# EAGLE schematic USB IMU Board (EAGLE 7.3.0)

## Sheet 1 of 2: USB Hub
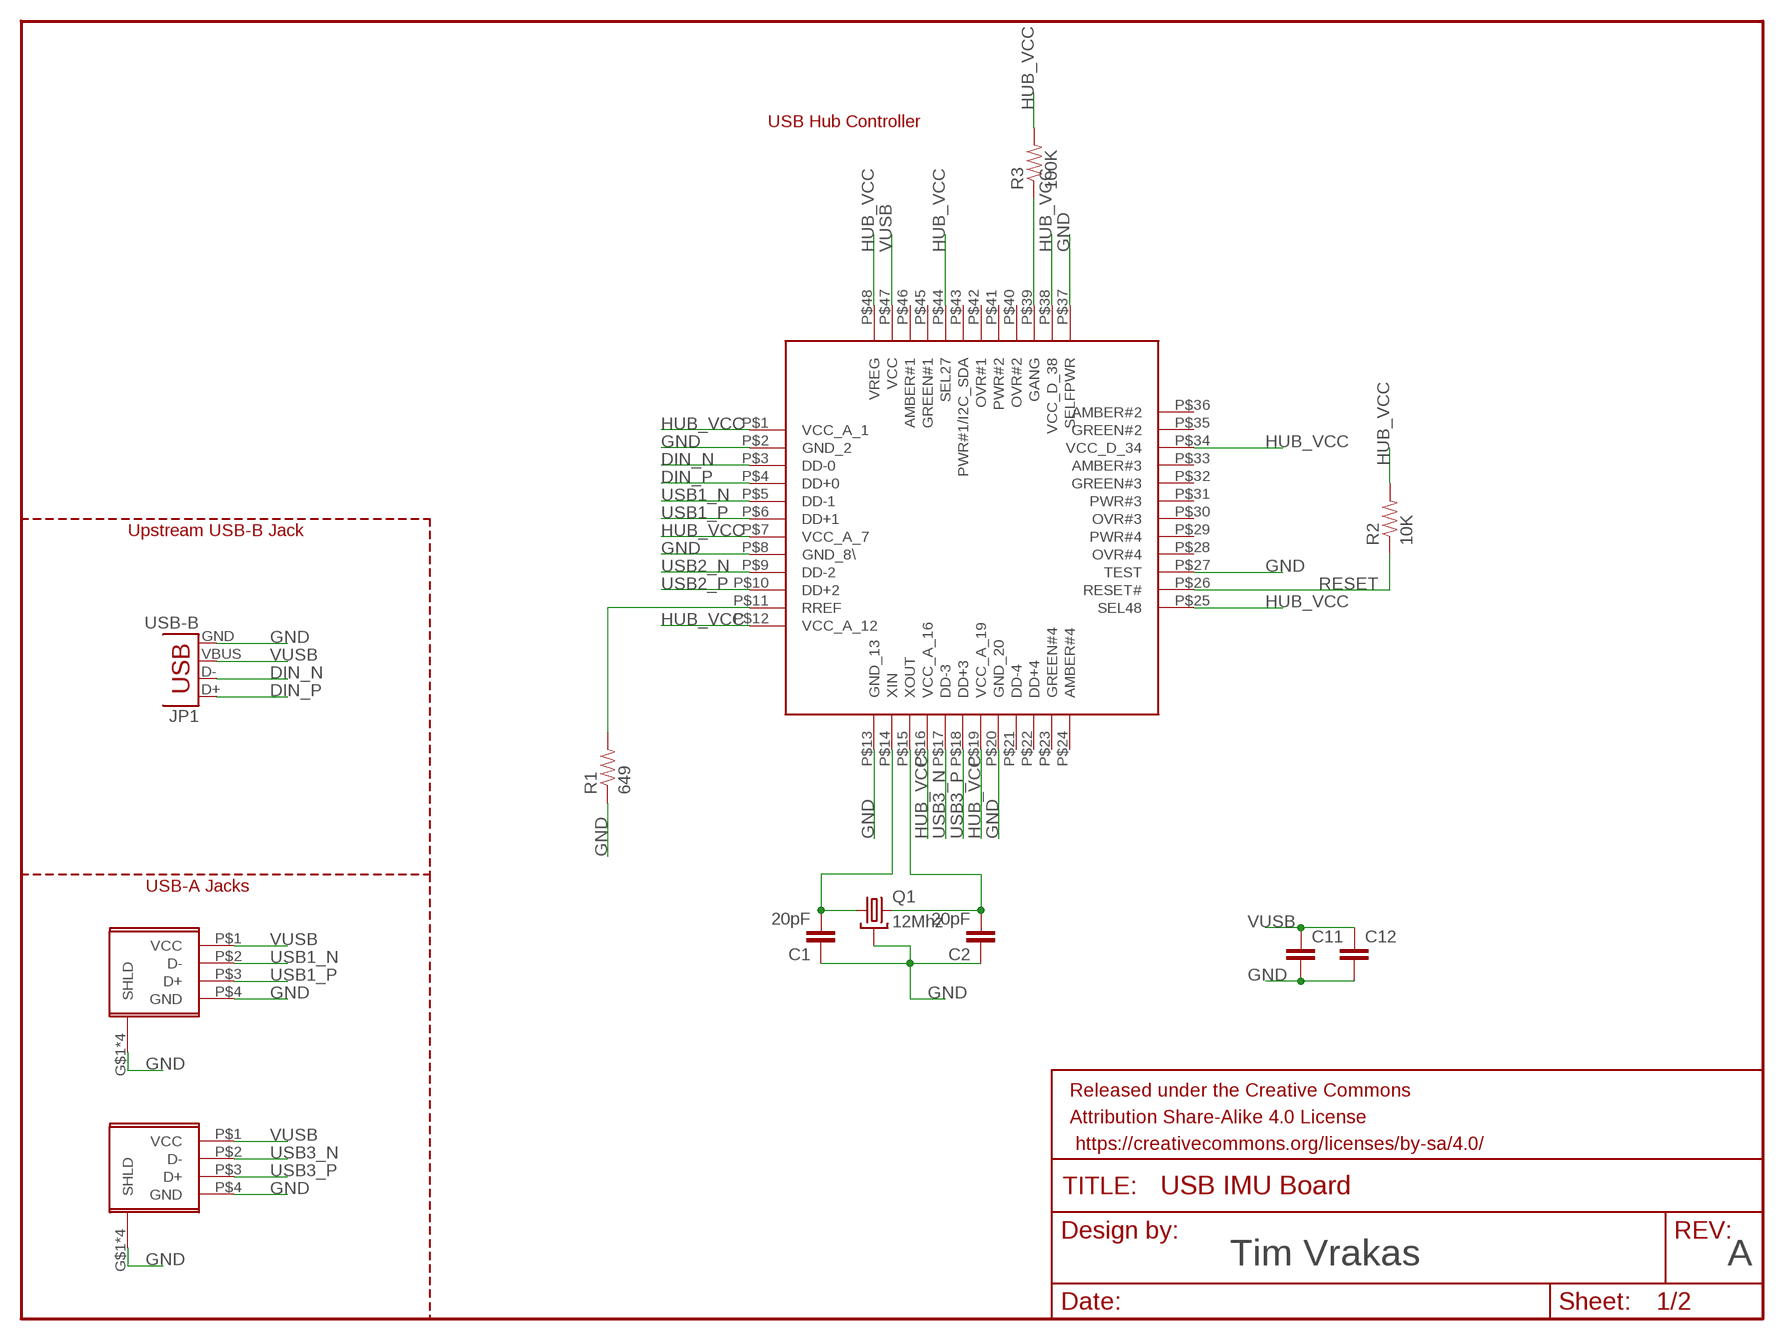
[diagram p0: schematic, sheet 1]

### Parts
C1  20pF  CAP0805  [0805]
C2  20pF  CAP0805  [0805]
C11  CAP0805  [0805]
C12  CAP0805  [0805]
FRAME1  FRAME-LETTERNO_PACKAGE  [DUMMY]
JP1  USB-B  USBPTH  [USB-B-PTH]
Q1  12Mhz  CRYSTAL3.2X2.5  [CRYSTAL-SMD-5X3]
R1  649  RESISTOR0805-RES  [0805]
R2  10K  RESISTOR0805-RES  [0805]
R3  100K  RESISTOR0805-RES  [0805]
U$3  CY7C65642  [TQFP-48]
U$5  USB-SOCKET  [TE-1932854-1-USB]
U$6  USB-SOCKET  [TE-1932854-1-USB]

### Nets
DIN_N [USB1]: JP1.D- U$3.P$3(DD-0)
DIN_P [USB1]: JP1.D+ U$3.P$4(DD+0)
GND: C1.1 C2.1 C11.2 C12.2 JP1.GND Q1.2(GND) Q1.4(GND) R1.1 U$3.P$2(GND_2) U$3.P$8(GND_8\) U$3.P$13(GND_13) U$3.P$20(GND_20) U$3.P$27(TEST) U$3.P$37(SELFPWR) U$5.G$1(SHLD) U$5.G$2(SHLD) U$5.G$3(SHLD) U$5.G$4(SHLD) U$5.P$4(GND) U$6.G$1(SHLD) U$6.G$2(SHLD) U$6.G$3(SHLD) U$6.G$4(SHLD) U$6.P$4(GND) ; also sheet 2
HUB_VCC: R2.2 R3.2 U$3.P$1(VCC_A_1) U$3.P$7(VCC_A_7) U$3.P$12(VCC_A_12) U$3.P$16(VCC_A_16) U$3.P$19(VCC_A_19) U$3.P$25(SEL48) U$3.P$34(VCC_D_34) U$3.P$38(VCC_D_38) U$3.P$44(SEL27) U$3.P$48(VREG)
N$1: R1.2 U$3.P$11(RREF)
N$2: R3.1 U$3.P$39(GANG)
N$4: C1.2 Q1.1 U$3.P$14(XIN)
N$6: C2.2 Q1.3 U$3.P$15(XOUT)
RESET: R2.1 U$3.P$26(RESET#)
USB1_N: U$3.P$5(DD-1) U$5.P$2(D-)
USB1_P: U$3.P$6(DD+1) U$5.P$3(D+)
USB2_N: U$3.P$9(DD-2) ; also sheet 2
USB2_P: U$3.P$10(DD+2) ; also sheet 2
USB3_N: U$3.P$17(DD-3) U$6.P$2(D-)
USB3_P: U$3.P$18(DD+3) U$6.P$3(D+)
VUSB: C11.1 C12.1 JP1.VBUS U$3.P$47(VCC) U$5.P$1(VCC) U$6.P$1(VCC) ; also sheet 2
Unconnected: U$3.P$21(DD-4) U$3.P$22(DD+4) U$3.P$23(GREEN#4) U$3.P$24(AMBER#4) U$3.P$28(OVR#4) U$3.P$29(PWR#4) U$3.P$30(OVR#3) U$3.P$31(PWR#3) U$3.P$32(GREEN#3) U$3.P$33(AMBER#3) U$3.P$35(GREEN#2) U$3.P$36(AMBER#2) U$3.P$40(OVR#2) U$3.P$41(PWR#2) U$3.P$42(OVR#1) U$3.P$43(PWR#1/I2C_SDA) U$3.P$45(GREEN#1) U$3.P$46(AMBER#1)

### Notes on the sheet
- USB Hub Controller
- Upstream USB-B Jack
- USB-A Jacks

## Sheet 2 of 2: IMU/GPS
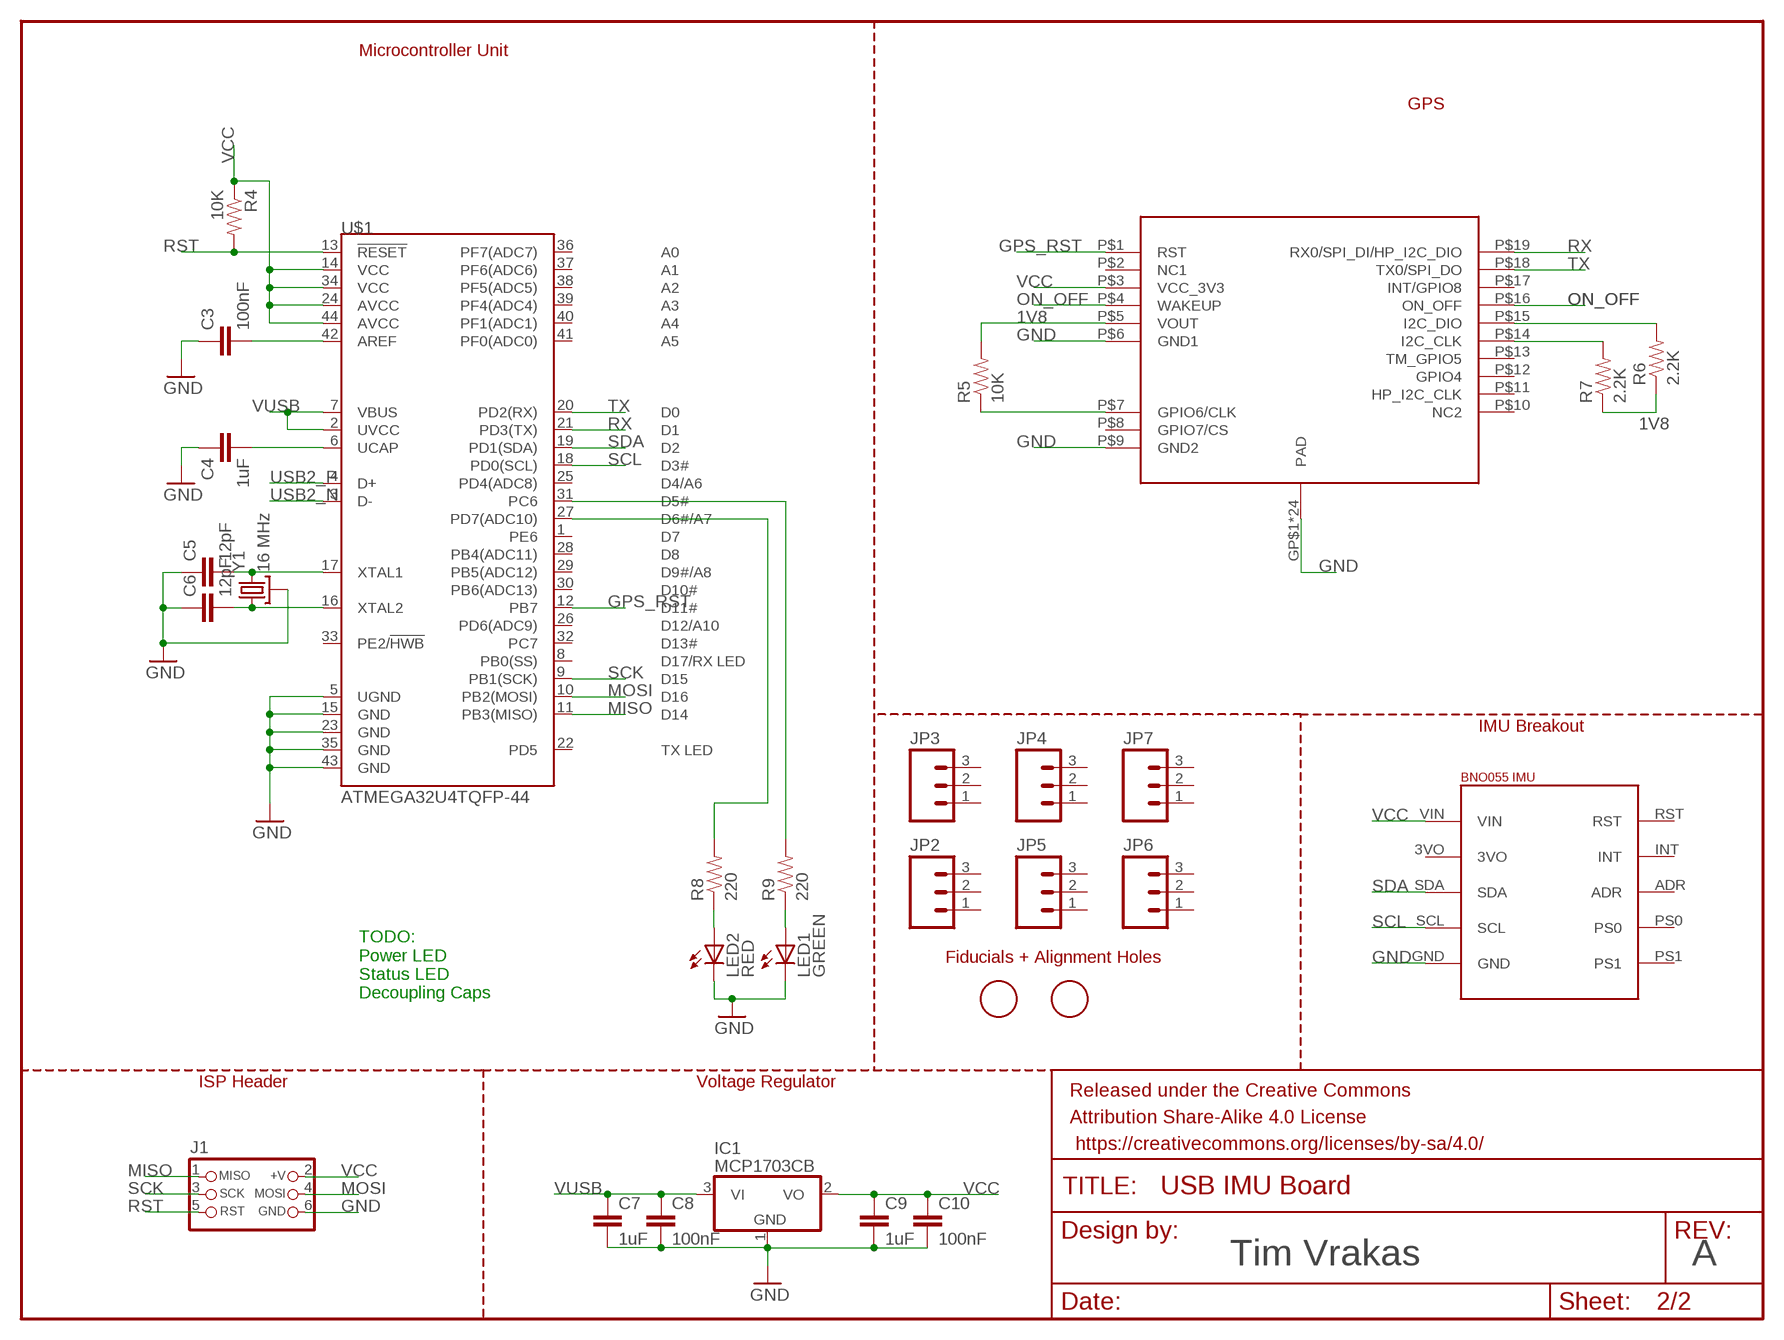
[diagram p1: schematic, sheet 2]

### Parts
C3  100nF  CAP0805  [0805]
C4  1uF  CAP0805  [0805]
C5  12pF  CAP0805  [0805]
C6  12pF  CAP0805  [0805]
C7  1uF  CAP0805  [0805]
C8  100nF  CAP0805  [0805]
C9  1uF  CAP0805  [0805]
C10  100nF  CAP0805  [0805]
FRAME2  FRAME-LETTERNO_PACKAGE  [DUMMY]
IC1  MCP1703CB  [SOT23]
J1  CON_HEADER_PRG_AVR_ICSP-SMD  [M2X3_SMD]
JP2  M03PTH  [1X03]
JP3  M03PTH  [1X03]
JP4  M03PTH  [1X03]
JP5  M03PTH  [1X03]
JP6  M03PTH  [1X03]
JP7  M03PTH  [1X03]
LED1  GREEN  LEDSML0805  [SML0805]
LED2  RED  LEDSML0805  [SML0805]
R4  10K  RESISTOR0805-RES  [0805]
R5  10K  RESISTOR0805-RES  [0805]
R6  2.2K  RESISTOR0805-RES  [0805]
R7  2.2K  RESISTOR0805-RES  [0805]
R8  220  RESISTOR0805-RES  [0805]
R9  220  RESISTOR0805-RES  [0805]
U$1  ATMEGA32U4TQFP-44  [TQFP44]
U$2  A2235-H  [A2235-H]
U$4  BNO055-IMU  [BNO055-BREAKOUT]
U$7  FIDUCIAL  [FIDUCIAL_1MM]
U$8  FIDUCIAL  [FIDUCIAL_1MM]
Y1  16 MHz  CRYSTAL3.2X2.5  [CRYSTAL-SMD-5X3]

### Nets
1V8: R5.2 R6.1 R7.1 U$2.P$5(VOUT)
GND: C3.1 C4.1 C5.1 C6.1 C7.2 C8.2 C9.2 C10.2 IC1.1(GND) J1.6(GND) LED1.C LED2.C U$1.5(UGND) U$1.15(GND) U$1.23(GND) U$1.35(GND) U$1.43(GND) U$2.GP$1(PAD) U$2.GP$2(PAD) U$2.GP$3(PAD) U$2.GP$4(PAD) U$2.GP$5(PAD) U$2.GP$6(PAD) U$2.GP$7(PAD) U$2.GP$8(PAD) U$2.GP$9(PAD) U$2.GP$10(PAD) U$2.GP$11(PAD) U$2.GP$12(PAD) U$2.GP$13(PAD) U$2.GP$14(PAD) U$2.GP$15(PAD) U$2.GP$16(PAD) U$2.GP$17(PAD) U$2.GP$18(PAD) U$2.GP$19(PAD) U$2.GP$20(PAD) U$2.GP$21(PAD) U$2.GP$22(PAD) U$2.GP$23(PAD) U$2.GP$24(PAD) U$2.P$6(GND1) U$2.P$9(GND2) U$4.GND Y1.2(GND) Y1.4(GND) ; also sheet 1
GPS_RST: U$1.12(PB7) U$2.P$1(RST)
MISO: J1.1(MISO) U$1.11(PB3(MISO))
MOSI: J1.4(MOSI) U$1.10(PB2(MOSI))
N$3: C3.2 U$1.42(AREF)
N$5: C5.2 U$1.17(XTAL1) Y1.3
N$7: C6.2 U$1.16(XTAL2) Y1.1
N$8: R5.1 U$2.P$7(GPIO6/CLK)
N$9: C4.2 U$1.6(UCAP)
N$10: R6.2 U$2.P$15(I2C_DIO)
N$11: R7.2 U$2.P$14(I2C_CLK)
N$12: LED1.A R9.1
N$13: LED2.A R8.1
N$14: R9.2 U$1.31(PC6)
N$15: R8.2 U$1.27(PD7(ADC10))
ON_OFF: U$2.P$4(WAKEUP) U$2.P$16(ON_OFF)
RST: J1.5(RST) R4.2 U$1.13(!RESET)
RX: U$1.21(PD3(TX)) U$2.P$19(RX0/SPI_DI/HP_I2C_DIO)
SCK: J1.3(SCK) U$1.9(PB1(SCK))
SCL: U$1.18(PD0(SCL)) U$4.SCL
SDA: U$1.19(PD1(SDA)) U$4.SDA
TX: U$1.20(PD2(RX)) U$2.P$18(TX0/SPI_DO)
USB2_N: U$1.3(D-) ; also sheet 1
USB2_P: U$1.4(D+) ; also sheet 1
VCC: C9.1 C10.1 IC1.2(VO) J1.2(+V) R4.1 U$1.14(VCC) U$1.24(AVCC) U$1.34(VCC) U$1.44(AVCC) U$2.P$3(VCC_3V3) U$4.VIN
VUSB: C7.1 C8.1 IC1.3(VI) U$1.2(UVCC) U$1.7(VBUS) ; also sheet 1
Unconnected: JP2.1 JP2.2 JP2.3 JP3.1 JP3.2 JP3.3 JP4.1 JP4.2 JP4.3 JP5.1 JP5.2 JP5.3 JP6.1 JP6.2 JP6.3 JP7.1 JP7.2 JP7.3 U$1.1(PE6) U$1.8(PB0(SS)) U$1.22(PD5) U$1.25(PD4(ADC8)) U$1.26(PD6(ADC9)) U$1.28(PB4(ADC11)) U$1.29(PB5(ADC12)) U$1.30(PB6(ADC13)) U$1.32(PC7) U$1.33(PE2/!HWB) U$1.36(PF7(ADC7)) U$1.37(PF6(ADC6)) U$1.38(PF5(ADC5)) U$1.39(PF4(ADC4)) U$1.40(PF1(ADC1)) U$1.41(PF0(ADC0)) U$2.P$2(NC1) U$2.P$8(GPIO7/CS) U$2.P$10(NC2) U$2.P$11(HP_I2C_CLK) U$2.P$12(GPIO4) U$2.P$13(TM_GPIO5) U$2.P$17(INT/GPIO8) U$4.3VO U$4.ADR U$4.INT U$4.PS0 U$4.PS1 U$4.RST

### Notes on the sheet
- Microcontroller Unit
- GPS
- IMU Breakout
- Fiducials + Alignment Holes
- TODO:
  Power LED
  Status LED
  Decoupling Caps
- ISP Header | Voltage Regulator

## Library data of the parts
C1-C10 = SparkFun-Passives:CAP: Capacitor Standard 0603 ceramic capacitor, and 0.1" leaded capacitor.
C11 C12 = SparkFun-Capacitors:CAP: Capacitor Standard 0603 ceramic capacitor, and 0.1" leaded capacitor.
FRAME1 FRAME2 = SparkFun-Aesthetics:FRAME-LETTER: Schematic Frame Standard 8.5x11 US Letter frame; DESIGNER: Tim Vrakas; VERSION: A
IC1 = linear:MCP1703: 250 mA, 16V, Low Quiescent Current LDO Regulator Source: http://ww1.microchip.com/downloads/en/DeviceDoc/22049b.pdf
J1 = dp_devices:CON_HEADER_PRG_AVR_ICSP: 2x3 AVR ICSP programming header
JP1 = SparkFun-Connectors:USB: USB Connectors USB-B-PTH is fully proven SKU : PRT-00139/CONN-08278 USB-miniB is fully proven SKU : PRT-00587 USB-A-PCB is untested. USB-A-H is throughly reviewed, but untested. Spark Fun Electronics SKU : PRT-00437 USB-B-SMT is throughly reviewed, but untested. Needs silkscreen touching up. USB-A-S has not been used/tested USB-MB-H has not been used/tested USB-MICROB has been used. CONN-09505; PROD_ID: CONN-08278
JP2-JP7 = SparkFun-Connectors:M03: Header 3 Standard 3-pin 0.1" header. Use with straight break away headers (SKU : PRT-00116), right angle break away headers (PRT-00553), swiss pins (PRT-00743), machine pins (PRT-00117), and female headers (PRT-00115). Molex polarized connector foot print use with SKU : PRT-08232 with associated crimp pins and housings.
LED1 LED2 = led:LED: LED OSRAM: - CHIPLED LG R971, LG N971, LY N971, LG Q971, LY Q971, LO R971, LY R971 LH N974, LH R974 LS Q976, LO Q976, LY Q976 LO Q996 - Hyper CHIPLED LW Q18S LB Q993, LB Q99A, LB R99A - SideLED LS A670, LO A670, LY A670, LG A670, LP A670 LB A673, LV A673, LT A673, LW A673 LH A674 LY A675 LS A676, LA A676, LO A676, LY A676, LW A676 LS A679, LY A679, LG A679 - Hyper Micro SIDELED® LS Y876, LA Y876, LO Y876, LY Y876 LT Y87S - SmartLED LW L88C, LW L88S LB L89C, LB L89S, LG L890 LS L89K, LO L89K, LY L89K LS L896, LA L896, LO L896, LY L896 - TOPLED LS T670, LO T670, LY T670, LG T670, LP T670 LSG T670, LSP T670, LSY T670, LOP T670, LYG T670 LG T671, LOG T671, LSG T671 LB T673, LV T673, LT T673, LW T673 LH T674 LS T676, LA T676, LO T676, LY T676, LB T676, LH T676, LSB T676, LW T676 LB T67C, LV T67C, LT T67C, LS T67K, LO T67K, LY T67K, LW E67C LS E67B, LA E67B, LO E67B, LY E67B, LB E67C, LV E67C, LT E67C LW T67C LS T679, LY T679, LG T679 LS T770, LO T770, LY T770, LG T770, LP T770 LB T773, LV T773, LT T773, LW T773 LH T774 LS E675, LA E675, LY E675, LS T675 LS T776, LA T776, LO T776, LY T776, LB T776 LHGB T686 LT T68C, LB T68C - Hyper Mini TOPLED® LB M676 - Mini TOPLED Santana® LG M470 LS M47K, LO M47K, LY M47K Source: http://www.osram.convergy.de LUXEON: - LUMILED® LXK2-PW12-R00, LXK2-PW12-S00, LXK2-PW14-U00, LXK2-PW14-V00 LXK2-PM12-R00, LXK2-PM12-S00, LXK2-PM14-U00 LXK2-PE12-Q00, LXK2-PE12-R00, LXK2-PE12-S00, LXK2-PE14-T00, LXK2-PE14-U00 LXK2-PB12-K00, LXK2-PB12-L00, LXK2-PB12-M00, LXK2-PB14-N00, LXK2-PB14-P00, LXK2-PB14-Q00 LXK2-PR12-L00, LXK2-PR12-M00, LXK2-PR14-Q00, LXK2-PR14-R00 LXK2-PD12-Q00, LXK2-PD12-R00, LXK2-PD12-S00 LXK2-PH12-R00, LXK2-PH12-S00 LXK2-PL12-P00, LXK2-PL12-Q00, LXK2-PL12-R00 Source: www.luxeon.com KINGBRIGHT: KA-3528ASYC Source: www.kingbright.com
Q1 Y1 = crystal_3225:CRYSTAL: Various standard crystals. Proven footprints. Spark Fun Electronics SKU : COM-00534
R1-R7 = SparkFun-Passives:RESISTOR: Resistor Basic schematic elements and footprints for 0603, 1206, and PTH resistors.
R8 R9 = SparkFun-Resistors:RESISTOR: Resistor Basic schematic elements and footprints for 0603, 1206, and PTH resistors.
U$1 = SparkFun-DigitalIC:ATMEGA32U4: Atmel 44-pin 8-bit Microcontroller with 32KBytes of ISP Flash and USB Controller
U$2 = NASA Parts Lib:A2235-H
U$3 = NASA Parts Lib:CY7C65642
U$4 = NASA Parts Lib:BNO055-IMU
U$5 U$6 = NASA Parts Lib:USB-SOCKET
U$7 U$8 = adafruit:FIDUCIAL: For use by pick and place machines to calibrate the vision/machine, 1mm By microbuilder.eu